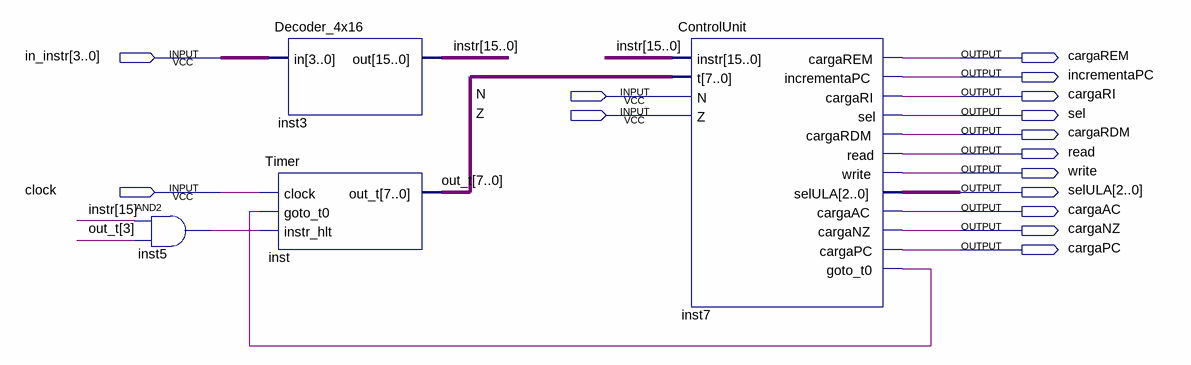
[diagram p0: schematic sheet]
// Quartus schematic TesteControlUnit.bdf as structural Verilog: 4 symbols, 15 pins
module TesteControlUnit (
  input  [3:0] in_instr,
  input  N,
  input  Z,
  input  clock,
  output cargaREM,
  output incrementaPC,
  output cargaRI,
  output sel,
  output cargaRDM,
  output read,
  output write,
  output [2:0] selULA,
  output cargaAC,
  output cargaNZ,
  output cargaPC
);

  wire inst5_out, inst7_goto_t0;
  wire [7:0] out_t;
  wire [15:0] instr;

  and inst5 (inst5_out, instr[15], out_t[3]);
  Decoder_4x16 inst3 (.in(in_instr), .out(instr));
  Timer inst (.clock(clock), .goto_t0(inst7_goto_t0), .instr_hlt(inst5_out), .out_t(out_t));
  ControlUnit inst7 (
    .instr(instr), .t(out_t), .N(N), .Z(Z), .cargaREM(cargaREM), .incrementaPC(incrementaPC),
    .cargaRI(cargaRI), .sel(sel), .cargaRDM(cargaRDM), .read(read), .write(write), .selULA(selULA),
    .cargaAC(cargaAC), .cargaNZ(cargaNZ), .cargaPC(cargaPC), .goto_t0(inst7_goto_t0));
endmodule
